# EAGLE schematic rev1 (EAGLE 8.2.2)

## Sheet 1 of 3
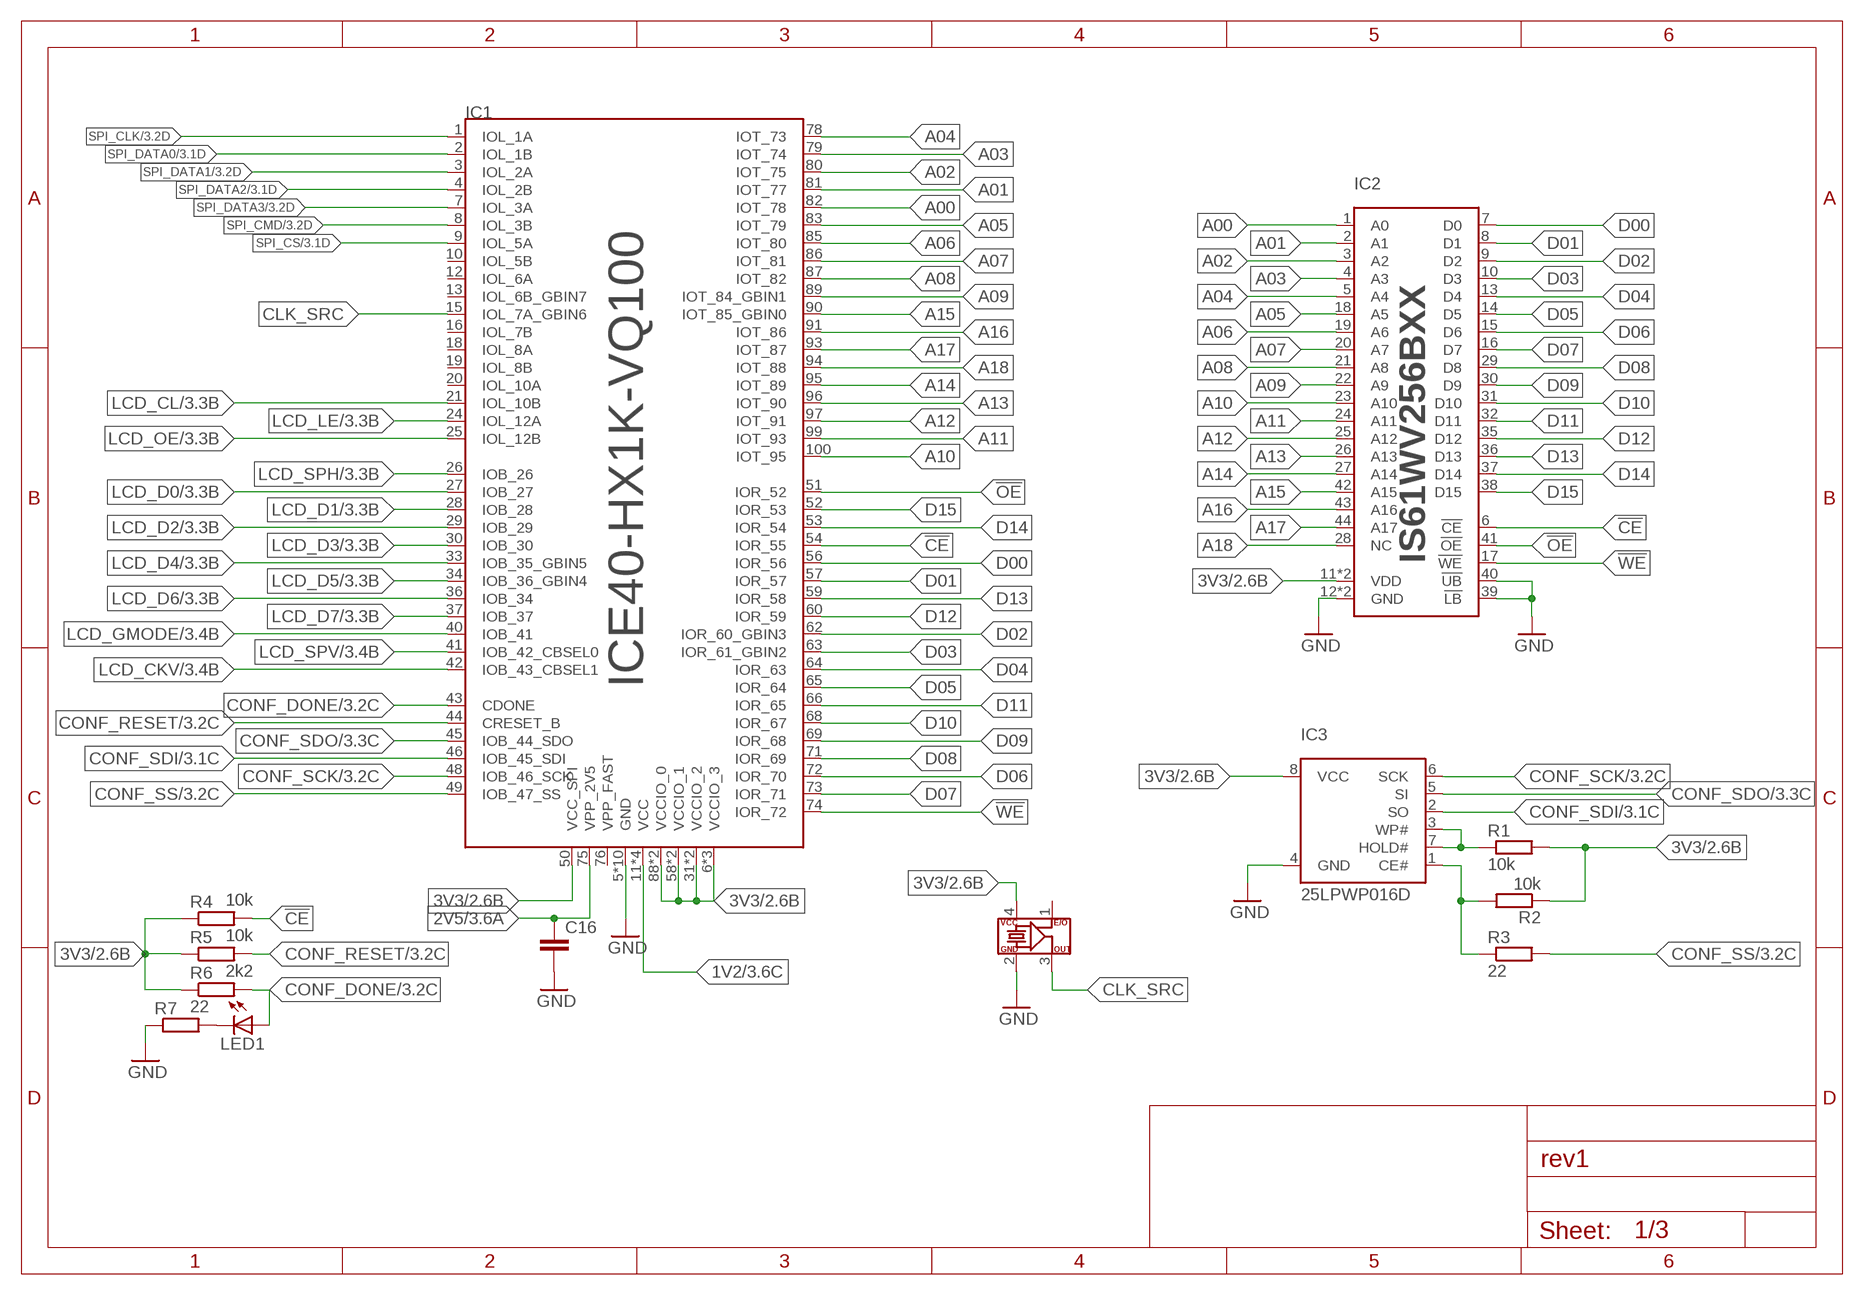
[diagram p0: schematic, sheet 1]

### Parts
C16  C-EUC0402  [C0402]
IC1  ICE40-HX1K-VQ100  [VQ100]
IC2  IS61WV256BXX  [TSOP-2]
IC3  25LPWP016D  [SOP08]
LED1  LEDCHIP-LED0603  [CHIP-LED0603]
R1  10k  R-EU_R0402  [R0402]
R2  10k  R-EU_R0603  [R0603]
R3  22  R-EU_R0402  [R0402]
R4  10k  R-EU_R0402  [R0402]
R5  10k  R-EU_R0402  [R0402]
R6  2k2  R-EU_R0402  [R0402]
R7  22  R-EU_R0402  [R0402]
X1  DSC61XX  [3225]

### Nets
1V2: IC1.11(VCC) IC1.35(VCC) IC1.61(VCC) IC1.77(VCC) ; also sheet 3
2V5: C16.1 IC1.75(VPP_2V5) ; also sheet 3
3V3: IC1.6(VCCIO_3) IC1.14(VCCIO_3) IC1.22(VCCIO_3) IC1.31(VCCIO_2) IC1.38(VCCIO_2) IC1.50(VCC_SPI) IC1.58(VCCIO_1) IC1.67(VCCIO_1) IC1.88(VCCIO_0) IC1.92(VCCIO_0) IC2.11(VDD) IC2.33(VDD) IC3.8(VCC) R1.2 R2.1 R4.1 R5.1 R6.1 X1.4 ; also sheet 2,3
!CE: IC1.54(IOR_55) IC2.6(!CE) R4.2
!OE: IC1.51(IOR_52) IC2.41(!OE)
!WE: IC1.74(IOR_72) IC2.17(!WE)
A00: IC1.82(IOT_78) IC2.1(A0)
A01: IC1.81(IOT_77) IC2.2(A1)
A02: IC1.80(IOT_75) IC2.3(A2)
A03: IC1.79(IOT_74) IC2.4(A3)
A04: IC1.78(IOT_73) IC2.5(A4)
A05: IC1.83(IOT_79) IC2.18(A5)
A06: IC1.85(IOT_80) IC2.19(A6)
A07: IC1.86(IOT_81) IC2.20(A7)
A08: IC1.87(IOT_82) IC2.21(A8)
A09: IC1.89(IOT_84_GBIN1) IC2.22(A9)
A10: IC1.100(IOT_95) IC2.23(A10)
A11: IC1.99(IOT_93) IC2.24(A11)
A12: IC1.97(IOT_91) IC2.25(A12)
A13: IC1.96(IOT_90) IC2.26(A13)
A14: IC1.95(IOT_89) IC2.27(A14)
A15: IC1.90(IOT_85_GBIN0) IC2.42(A15)
A16: IC1.91(IOT_86) IC2.43(A16)
A17: IC1.93(IOT_87) IC2.44(A17)
A18: IC1.94(IOT_88) IC2.28(NC)
CLK_SRC: IC1.15(IOL_7A_GBIN6) X1.3
CONF_DONE: IC1.43(CDONE) LED1.A R6.2 ; also sheet 3
CONF_RESET: IC1.44(CRESET_B) R5.2 ; also sheet 3
CONF_SCK: IC1.48(IOB_46_SCK) IC3.6(SCK) ; also sheet 3
CONF_SDI: IC1.46(IOB_45_SDI) IC3.2(SO) ; also sheet 3
CONF_SDO: IC1.45(IOB_44_SDO) IC3.5(SI) ; also sheet 3
CONF_SS: IC1.49(IOB_47_SS) R3.2 ; also sheet 3
D00: IC1.56(IOR_56) IC2.7(D0)
D01: IC1.57(IOR_57) IC2.8(D1)
D02: IC1.62(IOR_60_GBIN3) IC2.9(D2)
D03: IC1.63(IOR_61_GBIN2) IC2.10(D3)
D04: IC1.64(IOR_63) IC2.13(D4)
D05: IC1.65(IOR_64) IC2.14(D5)
D06: IC1.72(IOR_70) IC2.15(D6)
D07: IC1.73(IOR_71) IC2.16(D7)
D08: IC1.71(IOR_69) IC2.29(D8)
D09: IC1.69(IOR_68) IC2.30(D9)
D10: IC1.68(IOR_67) IC2.31(D10)
D11: IC1.66(IOR_65) IC2.32(D11)
D12: IC1.60(IOR_59) IC2.35(D12)
D13: IC1.59(IOR_58) IC2.36(D13)
D14: IC1.53(IOR_54) IC2.37(D14)
D15: IC1.52(IOR_53) IC2.38(D15)
GND: C16.2 IC1.5(GND) IC1.17(GND) IC1.23(GND) IC1.32(GND) IC1.39(GND) IC1.47(GND) IC1.55(GND) IC1.70(GND) IC1.84(GND) IC1.98(GND) IC2.12(GND) IC2.34(GND) IC2.39(!LB) IC2.40(!UB) IC3.4(GND) R7.1 X1.2 ; also sheet 2,3
LCD_CKV: IC1.42(IOB_43_CBSEL1) ; also sheet 3
LCD_CL: IC1.21(IOL_10B) ; also sheet 3
LCD_D0: IC1.27(IOB_27) ; also sheet 3
LCD_D1: IC1.28(IOB_28) ; also sheet 3
LCD_D2: IC1.29(IOB_29) ; also sheet 3
LCD_D3: IC1.30(IOB_30) ; also sheet 3
LCD_D4: IC1.33(IOB_35_GBIN5) ; also sheet 3
LCD_D5: IC1.34(IOB_36_GBIN4) ; also sheet 3
LCD_D6: IC1.36(IOB_34) ; also sheet 3
LCD_D7: IC1.37(IOB_37) ; also sheet 3
LCD_GMODE: IC1.40(IOB_41) ; also sheet 3
LCD_LE: IC1.24(IOL_12A) ; also sheet 3
LCD_OE: IC1.25(IOL_12B) ; also sheet 3
LCD_SPH: IC1.26(IOB_26) ; also sheet 3
LCD_SPV: IC1.41(IOB_42_CBSEL0) ; also sheet 3
N$1: IC3.3(WP#) IC3.7(HOLD#) R1.1
N$2: IC3.1(CE#) R2.2 R3.1
N$3: LED1.C R7.2
SPI_CLK: IC1.1(IOL_1A) ; also sheet 3
SPI_CMD: IC1.8(IOL_3B) ; also sheet 3
SPI_CS: IC1.9(IOL_5A) ; also sheet 3
SPI_DATA0: IC1.2(IOL_1B) ; also sheet 3
SPI_DATA1: IC1.3(IOL_2A) ; also sheet 3
SPI_DATA2: IC1.4(IOL_2B) ; also sheet 3
SPI_DATA3: IC1.7(IOL_3A) ; also sheet 3
Unconnected: IC1.10(IOL_5B) IC1.12(IOL_6A) IC1.13(IOL_6B_GBIN7) IC1.16(IOL_7B) IC1.18(IOL_8A) IC1.19(IOL_8B) IC1.20(IOL_10A) IC1.76(VPP_FAST) X1.1

## Sheet 2 of 3
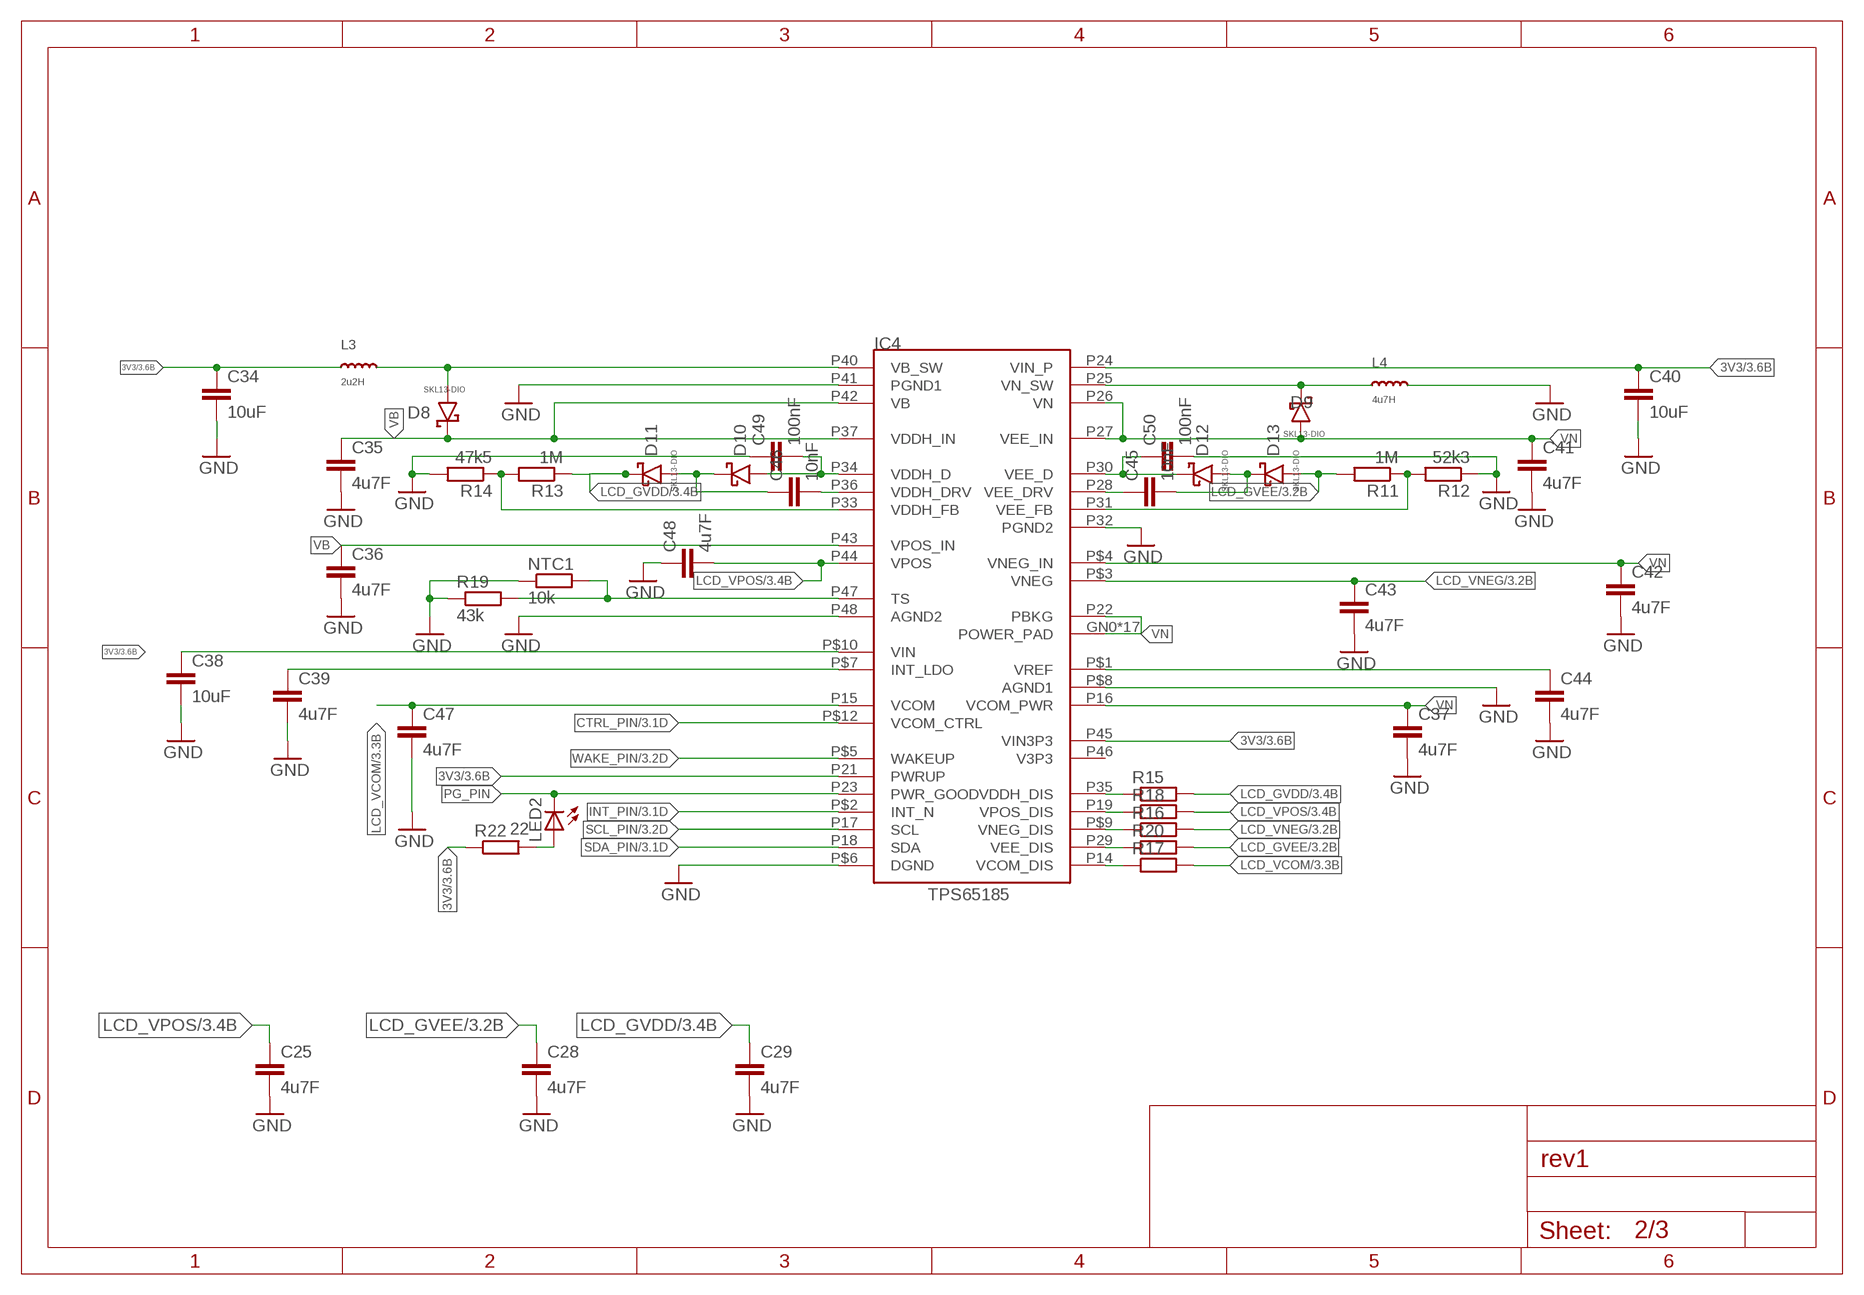
[diagram p1: schematic, sheet 2]

### Parts
C25  4u7F  C-EUC0603  [C0603]
C28  4u7F  C-EUC0603  [C0603]
C29  4u7F  C-EUC0603  [C0603]
C34  10uF  C-EUC0805  [C0805]
C35  4u7F  C-EUC0805  [C0805]
C36  4u7F  C-EUC0805  [C0805]
C37  4u7F  C-EUC0805  [C0805]
C38  10uF  C-EUC0805  [C0805]
C39  4u7F  C-EUC0603  [C0603]
C40  10uF  C-EUC0805  [C0805]
C41  4u7F  C-EUC0805  [C0805]
C42  4u7F  C-EUC0805  [C0805]
C43  4u7F  C-EUC0805  [C0805]
C44  4u7F  C-EUC0603  [C0603]
C45  10nF  C-EUC0402  [C0402]
C46  10nF  C-EUC0402  [C0402]
C47  4u7F  C-EUC0603  [C0603]
C48  4u7F  C-EUC0805  [C0805]
C49  100nF  C-EUC0402  [C0402]
C50  100nF  C-EUC0402  [C0402]
D8  SKL13-DIO  RB520S30T  [SOD523]
D9  SKL13-DIO  RB520S30T  [SOD523]
D10  SKL13-DIO  RB520S30T  [SOD523]
D11  SKL13-DIO  RB520S30T  [SOD523]
D12  SKL13-DIO  RB520S30T  [SOD523]
D13  SKL13-DIO  RB520S30T  [SOD523]
IC4  TPS65185  [RGZ]
L3  2u2H  DJNR-3015-2R2  [3015]
L4  4u7H  DJNR-3015-1R0  [3015]
LED2  LEDCHIP-LED0603  [CHIP-LED0603]
NTC1  10k  R-EU_R0603  [R0603]
R11  1M  R-EU_R0603  [R0603]
R12  52k3  R-EU_R0603  [R0603]
R13  1M  R-EU_R0603  [R0603]
R14  47k5  R-EU_R0603  [R0603]
R15  R-EU_R0603  [R0603]
R16  R-EU_R0603  [R0603]
R17  R-EU_R0603  [R0603]
R18  R-EU_R0603  [R0603]
R19  43k  R-EU_R0603  [R0603]
R20  R-EU_R0603  [R0603]
R22  22  R-EU_R0402  [R0402]

### Nets
3V3: C34.1 C38.1 C40.1 IC4.P21(PWRUP) IC4.P24(VIN_P) IC4.P45(VIN3P3) IC4.P$10(VIN) L3.P$1 R22.1 ; also sheet 1,3
CTRL_PIN: IC4.P$12(VCOM_CTRL) ; also sheet 3
GND: C25.2 C28.2 C29.2 C34.2 C35.2 C36.2 C37.2 C38.2 C39.2 C40.2 C41.2 C42.2 C43.2 C44.2 C47.2 C48.1 C49.1 C50.2 IC4.P32(PGND2) IC4.P41(PGND1) IC4.P48(AGND2) IC4.P$6(DGND) IC4.P$8(AGND1) L4.P$2 NTC1.1 R12.1 R14.2 R19.1 ; also sheet 1,3
INT_LDO1: C39.1 IC4.P$7(INT_LDO)
INT_PIN: IC4.P$2(INT_N) ; also sheet 3
LCD_GVDD: C29.1 D11.C R13.1 R15.2 ; also sheet 3
LCD_GVEE: C28.1 D13.A R11.2 R20.2 ; also sheet 3
LCD_VCOM: C47.1 IC4.P15(VCOM) R17.2 ; also sheet 3
LCD_VNEG: C43.1 IC4.P$3(VNEG) R16.2 ; also sheet 3
LCD_VPOS: C25.1 C48.2 IC4.P44(VPOS) R18.2 ; also sheet 3
N$8: LED2.A R22.2
N$41: D8.A IC4.P40(VB_SW) L3.P$2
N$42: D9.C IC4.P25(VN_SW) L4.P$1
N$43: C44.1 IC4.P$1(VREF)
N$44: C50.1 D12.C IC4.P30(VEE_D)
N$45: C49.2 D10.A IC4.P34(VDDH_D)
N$46: C46.1 D10.C D11.A
N$47: IC4.P31(VEE_FB) R11.1 R12.2
N$48: IC4.P33(VDDH_FB) R13.2 R14.1
N$49: C46.2 IC4.P36(VDDH_DRV)
N$50: C45.2 D12.A D13.C
N$51: C45.1 IC4.P28(VEE_DRV)
N$52: IC4.P35(VDDH_DIS) R15.1
N$53: IC4.P14(VCOM_DIS) R17.1
N$54: IC4.P19(VPOS_DIS) R18.1
N$55: IC4.P47(TS) NTC1.2 R19.2
N$56: IC4.P29(VEE_DIS) R20.1
PG_PIN: IC4.P23(PWR_GOOD) LED2.C
SCL_PIN: IC4.P17(SCL) ; also sheet 3
SDA_PIN: IC4.P18(SDA) ; also sheet 3
VB: C35.1 C36.1 D8.C IC4.P37(VDDH_IN) IC4.P42(VB) IC4.P43(VPOS_IN)
VN: C37.1 C41.1 C42.1 D9.A IC4.GN0(POWER_PAD) IC4.GN1(POWER_PAD) IC4.GN2(POWER_PAD) IC4.GN3(POWER_PAD) IC4.GN4(POWER_PAD) IC4.GN5(POWER_PAD) IC4.GN6(POWER_PAD) IC4.GN7(POWER_PAD) IC4.GN8(POWER_PAD) IC4.GN9(POWER_PAD) IC4.GN10(POWER_PAD) IC4.GN11(POWER_PAD) IC4.GN12(POWER_PAD) IC4.GN13(POWER_PAD) IC4.GN14(POWER_PAD) IC4.GN15(POWER_PAD) IC4.GN16(POWER_PAD) IC4.P16(VCOM_PWR) IC4.P22(PBKG) IC4.P26(VN) IC4.P27(VEE_IN) IC4.P$4(VNEG_IN)
VNEG_DIS1: IC4.P$9(VNEG_DIS) R16.1
WAKE_PIN: IC4.P$5(WAKEUP) ; also sheet 3
Unconnected: IC4.P46(V3P3)

## Sheet 3 of 3
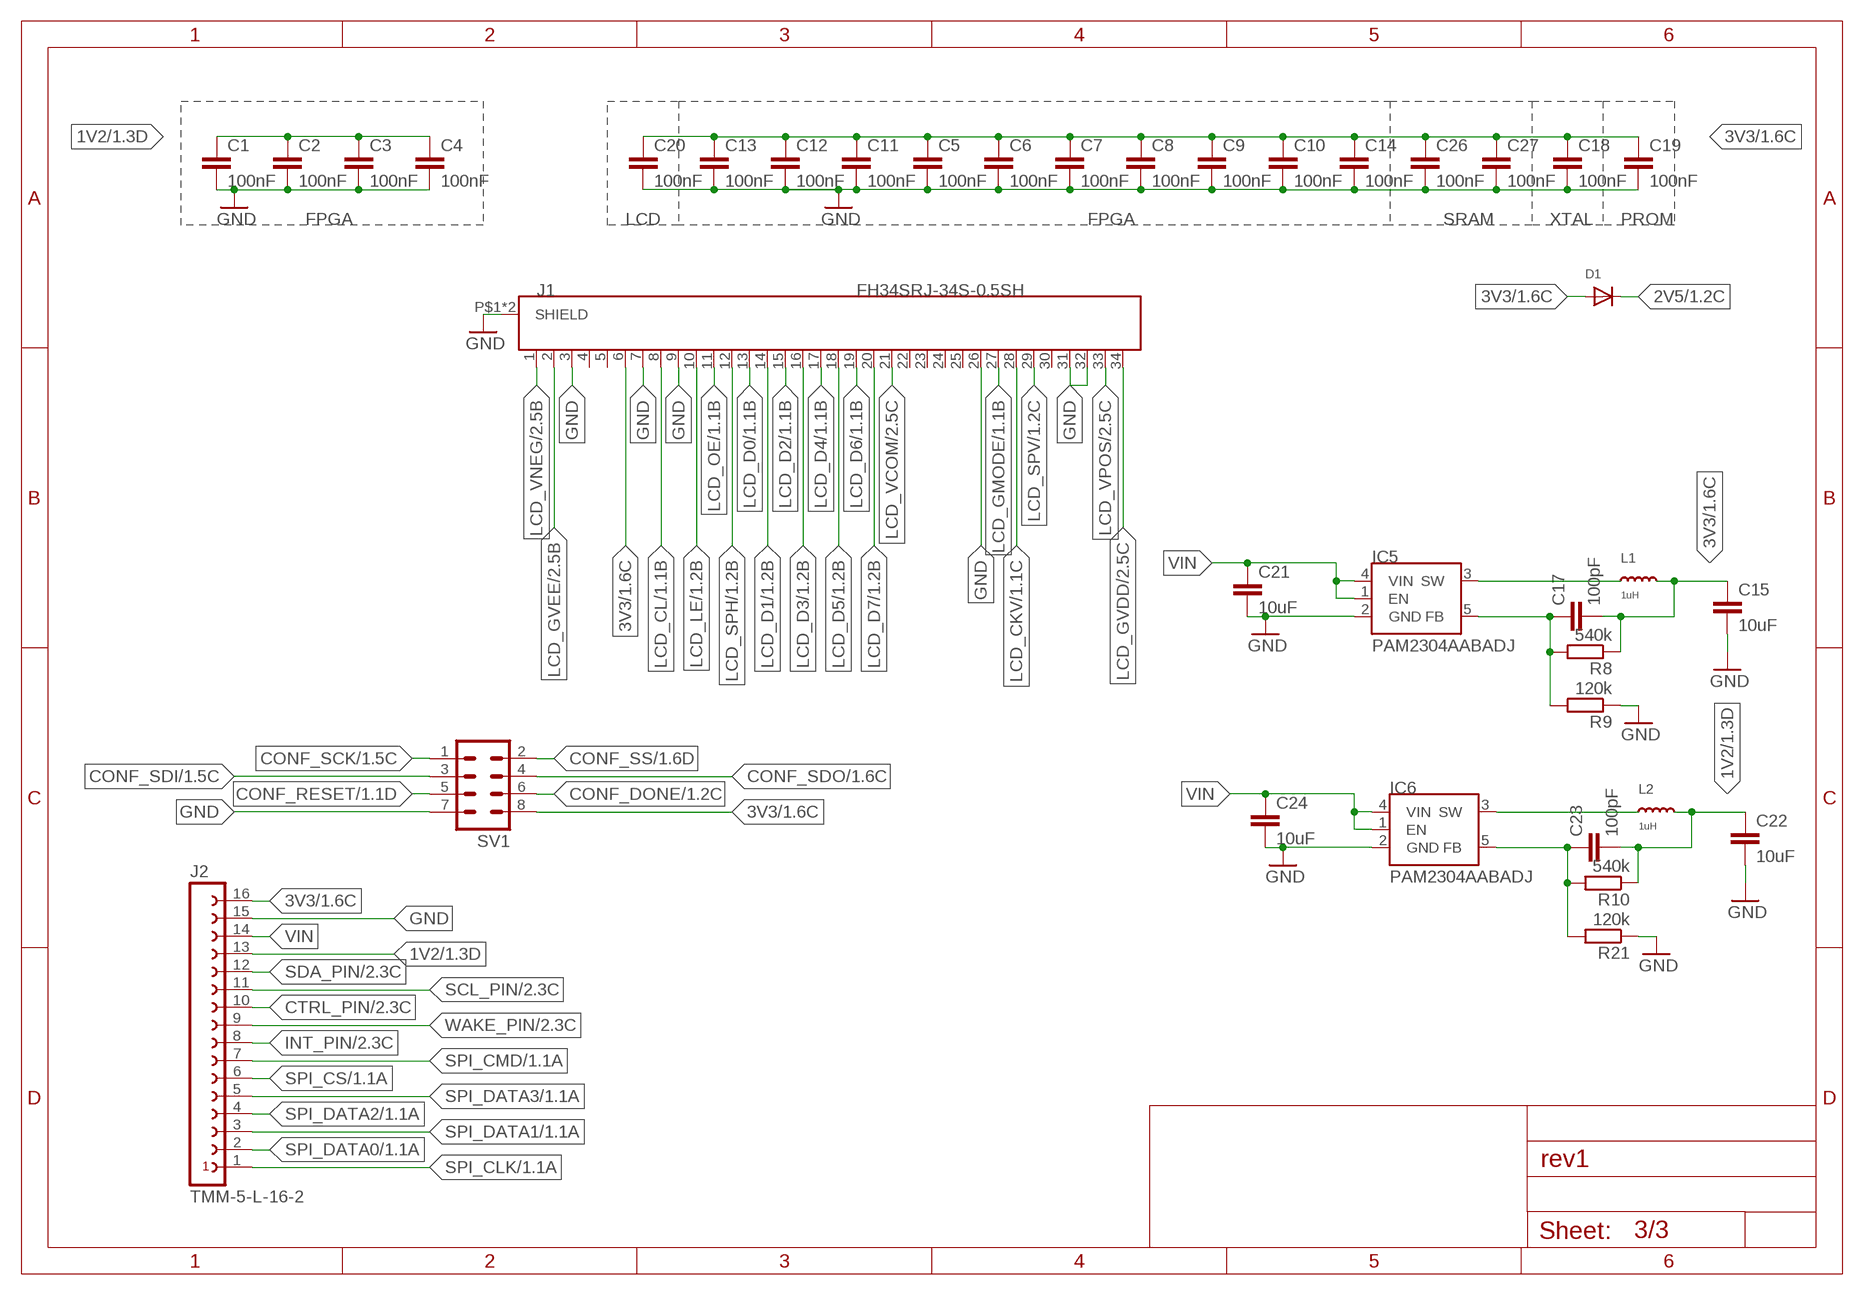
[diagram p2: schematic, sheet 3]

### Parts
C1  100nF  C-EUC0402  [C0402]
C2  100nF  C-EUC0402  [C0402]
C3  100nF  C-EUC0402  [C0402]
C4  100nF  C-EUC0402  [C0402]
C5  100nF  C-EUC0402  [C0402]
C6  100nF  C-EUC0402  [C0402]
C7  100nF  C-EUC0402  [C0402]
C8  100nF  C-EUC0402  [C0402]
C9  100nF  C-EUC0402  [C0402]
C10  100nF  C-EUC0402  [C0402]
C11  100nF  C-EUC0402  [C0402]
C12  100nF  C-EUC0402  [C0402]
C13  100nF  C-EUC0402  [C0402]
C14  100nF  C-EUC0402  [C0402]
C15  10uF  C-EUC0603  [C0603]
C17  100pF  C-EUC0402  [C0402]
C18  100nF  C-EUC0402  [C0402]
C19  100nF  C-EUC0402  [C0402]
C20  100nF  C-EUC0402  [C0402]
C21  10uF  C-EUC0603  [C0603]
C22  10uF  C-EUC0603  [C0603]
C23  100pF  C-EUC0402  [C0402]
C24  10uF  C-EUC0603  [C0603]
C26  100nF  C-EUC0402  [C0402]
C27  100nF  C-EUC0402  [C0402]
D1  DIODESOD-123  [SOD-123]
IC5  PAM2304AABADJ  [TSOT25]
IC6  PAM2304AABADJ  [TSOT25]
J1  FH34SRJ-34S-0.5SH  [FH34SRJ-34S-0.5SH]
J2  TMM-5-L-16-2  [TMM-5-L-16-2]
L1  1uH  DJNR-3015-1R0  [3015]
L2  1uH  DJNR-3015-1R0  [3015]
R8  540k  R-EU_R0402  [R0402]
R9  120k  R-EU_R0402  [R0402]
R10  540k  R-EU_R0402  [R0402]
R21  120k  R-EU_R0402  [R0402]
SV1  MA04-2  [MA04-2]

### Nets
1V2: C1.1 C2.1 C3.1 C4.1 C22.1 C23.2 J2.13 L2.P$2 R10.1 ; also sheet 1
2V5: D1.C ; also sheet 1
3V3: C5.1 C6.1 C7.1 C8.1 C9.1 C10.1 C11.1 C12.1 C13.1 C14.1 C15.1 C17.2 C18.1 C19.1 C20.1 C26.1 C27.1 D1.A J1.6 J2.16 L1.P$2 R8.1 SV1.8 ; also sheet 1,2
CONF_DONE: SV1.6 ; also sheet 1
CONF_RESET: SV1.5 ; also sheet 1
CONF_SCK: SV1.1 ; also sheet 1
CONF_SDI: SV1.3 ; also sheet 1
CONF_SDO: SV1.4 ; also sheet 1
CONF_SS: SV1.2 ; also sheet 1
CTRL_PIN: J2.10 ; also sheet 2
GND: C1.2 C2.2 C3.2 C4.2 C5.2 C6.2 C7.2 C8.2 C9.2 C10.2 C11.2 C12.2 C13.2 C14.2 C15.2 C18.2 C19.2 C20.2 C21.2 C22.2 C24.2 C26.2 C27.2 IC5.2(GND) IC6.2(GND) J1.3 J1.7 J1.9 J1.26 J1.31 J1.32 J1.P$1(SHIELD) J1.P$2(SHIELD) J2.15 R9.1 R21.1 SV1.7 ; also sheet 1,2
INT_PIN: J2.8 ; also sheet 2
LCD_CKV: J1.28 ; also sheet 1
LCD_CL: J1.8 ; also sheet 1
LCD_D0: J1.13 ; also sheet 1
LCD_D1: J1.14 ; also sheet 1
LCD_D2: J1.15 ; also sheet 1
LCD_D3: J1.16 ; also sheet 1
LCD_D4: J1.17 ; also sheet 1
LCD_D5: J1.18 ; also sheet 1
LCD_D6: J1.19 ; also sheet 1
LCD_D7: J1.20 ; also sheet 1
LCD_GMODE: J1.27 ; also sheet 1
LCD_GVDD: J1.34 ; also sheet 2
LCD_GVEE: J1.2 ; also sheet 2
LCD_LE: J1.10 ; also sheet 1
LCD_OE: J1.11 ; also sheet 1
LCD_SPH: J1.12 ; also sheet 1
LCD_SPV: J1.29 ; also sheet 1
LCD_VCOM: J1.21 ; also sheet 2
LCD_VNEG: J1.1 ; also sheet 2
LCD_VPOS: J1.33 ; also sheet 2
N$4: C17.1 IC5.5(FB) R8.2 R9.2
N$5: IC5.3(SW) L1.P$1
N$6: C23.1 IC6.5(FB) R10.2 R21.2
N$7: IC6.3(SW) L2.P$1
SCL_PIN: J2.11 ; also sheet 2
SDA_PIN: J2.12 ; also sheet 2
SPI_CLK: J2.1 ; also sheet 1
SPI_CMD: J2.7 ; also sheet 1
SPI_CS: J2.6 ; also sheet 1
SPI_DATA0: J2.2 ; also sheet 1
SPI_DATA1: J2.3 ; also sheet 1
SPI_DATA2: J2.4 ; also sheet 1
SPI_DATA3: J2.5 ; also sheet 1
VIN: C21.1 C24.1 IC5.1(EN) IC5.4(VIN) IC6.1(EN) IC6.4(VIN) J2.14
WAKE_PIN: J2.9 ; also sheet 2
Unconnected: J1.4 J1.5 J1.22 J1.23 J1.24 J1.25 J1.30

### Notes on the sheet
- FPGA | LCD | FPGA | SRAM | XTAL | PROM

## Library data of the parts
C1-C29 C34-C50 = rcl:C-EU: CAPACITOR, European symbol
D1 = adafruit:DIODE: Diode SMADIODE - SMA Surface Mount Package 20V 1A Schottky Diode Digikey: 641-1014-6-ND DO-1N4148 - Through Hole Small Current Diode SOD-123 20V 1 A (.5mV Vf) Schottky Diode - Digikey: MBRX120TPMSCT-ND SOD-323 10V 570mA (.38mV Vf, 3ns) Schottky Diode - Digikey: ZLLS410CT-ND SOD-523 30V 30mA Schottky Diode (RB751S-40TE61) - Digikey: RB751S-40TE61CT-ND SOT23-R/W - SOT23 Package (R = Solder Paste/Reflow Ovens, W = Hand-Soldering) BAT54Film 40V 300mA - Digikey: 497-7162-1-ND
D8-D13 = diodes:RB520S30T
IC1 = lattice:ICE40-HX1K-VQ100
IC2 = issi:IS61WV256BXX
IC3 = issi:25LPWP
IC4 = texas-instruments:TPS65185
IC5 IC6 = diodes-inc:PAM2304
J1 = connector:FH34SRJ
J2 = connector:TMM-5-L-16-2
L1-L3 = inductors:DJNR-3015-: Ferrocore SMD power coil 30x30x15mm series
L4 = inductors:DJNR-3015-: Ferrocore SMD power coil 30x30x15mm series; VALUE: 1uH
LED1 LED2 = led:LED: LED OSRAM: - CHIPLED LG R971, LG N971, LY N971, LG Q971, LY Q971, LO R971, LY R971 LH N974, LH R974 LS Q976, LO Q976, LY Q976 LO Q996 - Hyper CHIPLED LW Q18S LB Q993, LB Q99A, LB R99A - SideLED LS A670, LO A670, LY A670, LG A670, LP A670 LB A673, LV A673, LT A673, LW A673 LH A674 LY A675 LS A676, LA A676, LO A676, LY A676, LW A676 LS A679, LY A679, LG A679 - Hyper Micro SIDELED® LS Y876, LA Y876, LO Y876, LY Y876 LT Y87S - SmartLED LW L88C, LW L88S LB L89C, LB L89S, LG L890 LS L89K, LO L89K, LY L89K LS L896, LA L896, LO L896, LY L896 - TOPLED LS T670, LO T670, LY T670, LG T670, LP T670 LSG T670, LSP T670, LSY T670, LOP T670, LYG T670 LG T671, LOG T671, LSG T671 LB T673, LV T673, LT T673, LW T673 LH T674 LS T676, LA T676, LO T676, LY T676, LB T676, LH T676, LSB T676, LW T676 LB T67C, LV T67C, LT T67C, LS T67K, LO T67K, LY T67K, LW E67C LS E67B, LA E67B, LO E67B, LY E67B, LB E67C, LV E67C, LT E67C LW T67C LS T679, LY T679, LG T679 LS T770, LO T770, LY T770, LG T770, LP T770 LB T773, LV T773, LT T773, LW T773 LH T774 LS E675, LA E675, LY E675, LS T675 LS T776, LA T776, LO T776, LY T776, LB T776 LHGB T686 LT T68C, LB T68C - Hyper Mini TOPLED® LB M676 - Mini TOPLED Santana® LG M470 LS M47K, LO M47K, LY M47K Source: http://www.osram.convergy.de LUXEON: - LUMILED® LXK2-PW12-R00, LXK2-PW12-S00, LXK2-PW14-U00, LXK2-PW14-V00 LXK2-PM12-R00, LXK2-PM12-S00, LXK2-PM14-U00 LXK2-PE12-Q00, LXK2-PE12-R00, LXK2-PE12-S00, LXK2-PE14-T00, LXK2-PE14-U00 LXK2-PB12-K00, LXK2-PB12-L00, LXK2-PB12-M00, LXK2-PB14-N00, LXK2-PB14-P00, LXK2-PB14-Q00 LXK2-PR12-L00, LXK2-PR12-M00, LXK2-PR14-Q00, LXK2-PR14-R00 LXK2-PD12-Q00, LXK2-PD12-R00, LXK2-PD12-S00 LXK2-PH12-R00, LXK2-PH12-S00 LXK2-PL12-P00, LXK2-PL12-Q00, LXK2-PL12-R00 Source: www.luxeon.com KINGBRIGHT: KA-3528ASYC Source: www.kingbright.com
NTC1 R1-R22 = rcl:R-EU_: RESISTOR, European symbol
SV1 = con-lstb:MA04-2: PIN HEADER; OC_FARNELL: unknown; OC_NEWARK: unknown
X1 = microchip:DSC61XX